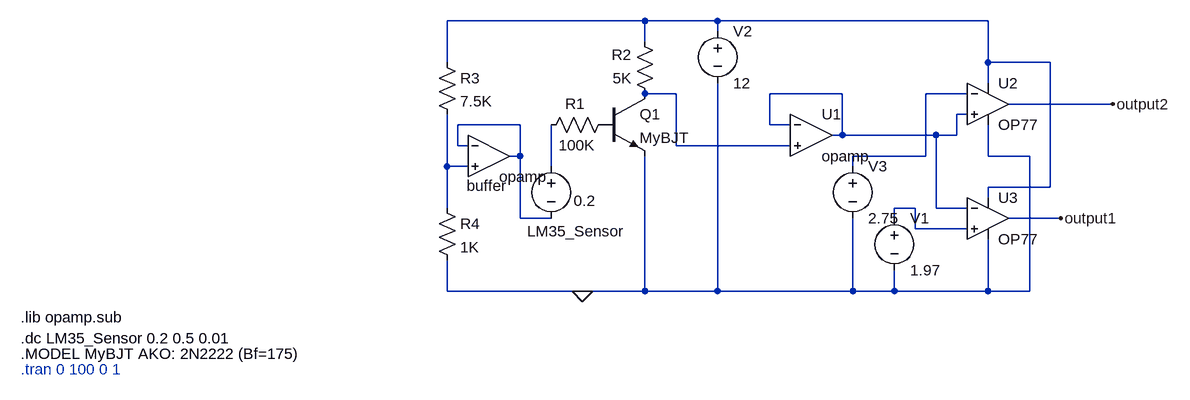
[diagram p0: schematic AmplifierDesign1.asc]
AmplifierDesign1.asc, the LTspice schematic file:
Version 4
SHEET 1 1236 680
WIRE 240 -32 -64 -32
WIRE 352 -32 240 -32
WIRE 768 -32 352 -32
WIRE 352 -16 352 -32
WIRE 240 0 240 -32
WIRE -64 32 -64 -32
WIRE 768 32 768 -32
WIRE 864 32 768 32
WIRE 768 64 768 32
WIRE 288 80 240 80
WIRE 544 80 432 80
WIRE 736 80 672 80
WIRE 960 96 800 96
WIRE 736 112 720 112
WIRE 48 128 -48 128
WIRE 432 128 432 80
WIRE 464 128 432 128
WIRE 544 144 544 80
WIRE 544 144 528 144
WIRE 688 144 544 144
WIRE 720 144 720 112
WIRE 720 144 688 144
WIRE -48 160 -48 128
WIRE -32 160 -48 160
WIRE 288 160 288 80
WIRE 464 160 288 160
WIRE 48 176 48 128
WIRE 48 176 32 176
WIRE 672 176 672 80
WIRE 672 176 560 176
WIRE 768 176 768 128
WIRE 832 176 768 176
WIRE -64 192 -64 112
WIRE -32 192 -64 192
WIRE 96 192 96 128
WIRE 560 192 560 176
WIRE 864 224 864 32
WIRE 864 224 768 224
WIRE 768 240 768 224
WIRE -64 256 -64 192
WIRE 656 256 624 256
WIRE 688 256 688 144
WIRE 736 256 688 256
WIRE 48 272 48 176
WIRE 96 272 48 272
WIRE 624 272 624 256
WIRE 880 272 800 272
WIRE 656 288 656 256
WIRE 736 288 656 288
WIRE -64 384 -64 336
WIRE 144 384 -64 384
WIRE 240 384 240 176
WIRE 240 384 144 384
WIRE 352 384 352 64
WIRE 352 384 240 384
WIRE 560 384 560 272
WIRE 560 384 352 384
WIRE 624 384 624 352
WIRE 624 384 560 384
WIRE 768 384 768 304
WIRE 768 384 624 384
WIRE 832 384 832 176
WIRE 832 384 768 384
FLAG 144 384 0
FLAG 960 96 output2
FLAG 880 272 output1
SYMBOL res 192 112 R90
WINDOW 0 -1 59 VBottom 2
WINDOW 3 32 56 VTop 2
SYMATTR InstName R1
SYMATTR Value 100K
SYMBOL res 256 96 R180
WINDOW 0 36 76 Left 2
WINDOW 3 36 40 Left 2
SYMATTR InstName R2
SYMATTR Value 5K
SYMBOL npn 176 80 R0
SYMATTR InstName Q1
SYMATTR Value MyBJT
SYMBOL voltage 96 176 R0
WINDOW 3 35 69 Left 2
WINDOW 123 0 0 Left 0
WINDOW 39 0 0 Left 0
WINDOW 0 -37 116 Left 2
SYMATTR Value 0.2
SYMATTR InstName LM35_Sensor
SYMBOL voltage 352 -32 R0
SYMATTR InstName V2
SYMATTR Value 12
SYMBOL res -80 16 R0
SYMATTR InstName R3
SYMATTR Value 7.5K
SYMBOL res -80 240 R0
SYMATTR InstName R4
SYMATTR Value 1K
SYMBOL OpAmps\\opamp 0 112 R0
WINDOW 0 -34 110 Left 2
SYMATTR InstName buffer
SYMBOL OpAmps\\opamp 496 80 R0
SYMATTR InstName U1
SYMBOL OpAmps\\OP77 768 32 R0
SYMATTR InstName U2
SYMBOL OpAmps\\OP77 768 208 R0
SYMATTR InstName U3
SYMBOL voltage 624 256 R0
SYMATTR InstName V1
SYMATTR Value 1.97
SYMBOL voltage 560 176 R0
SYMATTR InstName V3
SYMATTR Value 2.75
TEXT -720 504 Left 2 ;.tran 0 100 0 1
TEXT -720 480 Left 2 !.MODEL MyBJT AKO: 2N2222 (Bf=175)
TEXT -720 456 Left 2 !.dc LM35_Sensor 0.2 0.5 0.01
TEXT -720 424 Left 2 !.lib opamp.sub

The netlist it stands for:
* AmplifierDesign1.asc
R1 P001 N007 100K
R2 N002 N001 5K
Q1 N002 P001 0 0 MyBJT
V§LM35_Sensor N007 N005 0.2
V2 N001 0 12
R3 N001 N006 7.5K
R4 N006 0 1K
Xbuffer N005 N006 N005 opamp Aol=100K GBW=10Meg  ; pins invin noninvin out
XU1 N003 N002 N003 opamp Aol=100K GBW=10Meg  ; pins invin noninvin out
XU2 N003 N004 N001 0 output2 OP77  ; pins In+ In- V+ V- OUT
XU3 N008 N003 N001 0 output1 OP77  ; pins In+ In- V+ V- OUT
V1 N008 0 1.97
V3 N004 0 2.75
.model NPN NPN
.model PNP PNP
.lib standard.bjt
* .tran 0 100 0 1
.MODEL MyBJT AKO: 2N2222 (Bf=175)
.dc LM35_Sensor 0.2 0.5 0.01
.lib opamp.sub
.lib ADI.lib
.backanno
.end